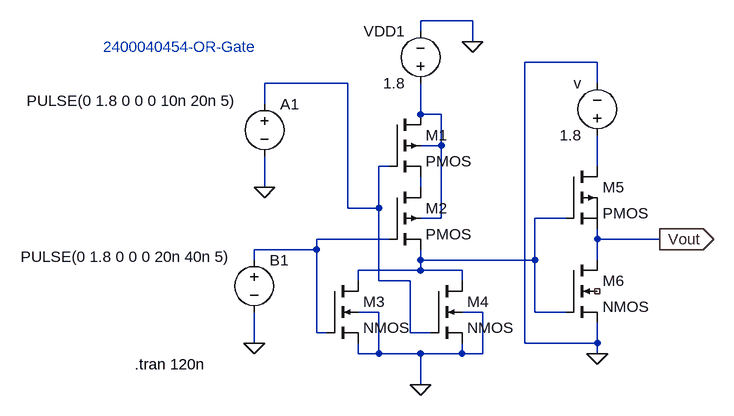
[diagram p0: schematic Or-gate-design.asc]
Or-gate-design.asc, the LTspice schematic file:
Version 4.1
SHEET 1 880 680
WIRE 464 -64 384 -64
WIRE 384 -48 384 -64
WIRE 464 -32 464 -64
WIRE 656 0 544 0
WIRE 272 32 144 32
WIRE 656 32 656 0
WIRE 144 64 144 32
WIRE 384 80 384 32
WIRE 416 80 384 80
WIRE 416 128 416 80
WIRE 416 128 384 128
WIRE 336 160 320 160
WIRE 656 160 656 112
WIRE 144 192 144 144
WIRE 384 192 384 176
WIRE 272 224 272 32
WIRE 320 224 320 160
WIRE 320 224 272 224
WIRE 416 240 416 128
WIRE 416 240 384 240
WIRE 608 240 560 240
WIRE 336 272 224 272
WIRE 656 272 656 256
WIRE 752 272 656 272
WIRE 224 288 224 272
WIRE 224 288 128 288
WIRE 128 304 128 288
WIRE 384 304 384 288
WIRE 560 304 560 240
WIRE 560 304 384 304
WIRE 656 304 656 272
WIRE 384 320 384 304
WIRE 384 320 288 320
WIRE 448 320 384 320
WIRE 288 336 288 320
WIRE 320 336 320 224
WIRE 368 336 320 336
WIRE 448 336 448 320
WIRE 320 384 288 384
WIRE 480 384 448 384
WIRE 560 384 560 304
WIRE 608 384 560 384
WIRE 224 416 224 288
WIRE 240 416 224 416
WIRE 368 416 368 336
WIRE 400 416 368 416
WIRE 128 432 128 384
WIRE 544 432 544 0
WIRE 656 432 656 400
WIRE 656 432 544 432
WIRE 288 448 288 432
WIRE 320 448 320 384
WIRE 320 448 288 448
WIRE 384 448 320 448
WIRE 448 448 448 432
WIRE 448 448 384 448
WIRE 480 448 480 384
WIRE 480 448 448 448
WIRE 656 448 656 432
WIRE 384 496 384 448
FLAG 384 496 0
FLAG 464 -32 0
FLAG 128 432 0
FLAG 144 192 0
FLAG 656 448 0
FLAG 752 272 Vout
IOPIN 752 272 Out
SYMBOL pmos4 336 80 R0
SYMATTR InstName M1
SYMBOL pmos4 336 192 R0
SYMATTR InstName M2
SYMBOL nmos4 240 336 R0
SYMATTR InstName M3
SYMBOL nmos4 400 336 R0
SYMATTR InstName M4
SYMBOL voltage 384 48 R180
WINDOW 0 24 96 Left 2
WINDOW 3 24 16 Left 2
SYMATTR InstName VDD1
SYMATTR Value 1.8
SYMBOL voltage 144 48 R0
WINDOW 3 -366 11 Left 2
WINDOW 123 0 0 Left 0
WINDOW 39 0 0 Left 0
SYMATTR InstName A1
SYMATTR Value PULSE(0 1.8 0 0 0 10n 20n 5)
SYMBOL voltage 128 288 R0
WINDOW 3 -359 11 Left 2
WINDOW 123 0 0 Left 0
WINDOW 39 0 0 Left 0
SYMATTR InstName B1
SYMATTR Value PULSE(0 1.8 0 0 0 20n 40n 5)
SYMBOL pmos 608 160 R0
SYMATTR InstName M5
SYMBOL nmos4 608 304 R0
SYMATTR InstName M6
SYMBOL voltage 656 128 R180
WINDOW 0 24 96 Left 2
WINDOW 3 24 16 Left 2
SYMATTR InstName v
SYMATTR Value 1.8
TEXT -56 464 Left 2 !.tran 120n
TEXT -104 -24 Left 2 ;2400040454-OR-Gate

The netlist it stands for:
* Or-gate-design.asc
M1 N002 N001 N004 N002 PMOS
M2 N004 N006 N005 N002 PMOS
M3 N005 N006 0 0 NMOS
M4 N005 N001 0 0 NMOS
VDD1 N002 0 1.8
V§A1 N001 0 PULSE(0 1.8 0 0 0 10n 20n 5)
V§B1 N006 0 PULSE(0 1.8 0 0 0 20n 40n 5)
M5 N003 N005 Vout Vout PMOS
M6 Vout N005 0 NC_01 NMOS
v N003 0 1.8
.model NMOS NMOS
.model PMOS PMOS
.lib standard.mos
.tran 120n
* 2400040454-OR-Gate
.backanno
.end